# Altium schematic sheet CR20-0611.SchDoc
size A4; PageSetup: Record=PageOptions|CenterHorizontal=True|CenterVertical=True|PrintScale=1.00|XCorrection=1.00|YCorrection=1.00|PrintKind=0|BorderSize=5000000|LeftOffset=0|BottomOffset=0|Orientation=2|PaperLength=1000|PaperWidth=1000|Scale=100|PaperSource=7|PrintQuality=-3|MediaType=1|DitherType=10|PrintScaleMode=1|PaperKind=A4|PaperIndex=9
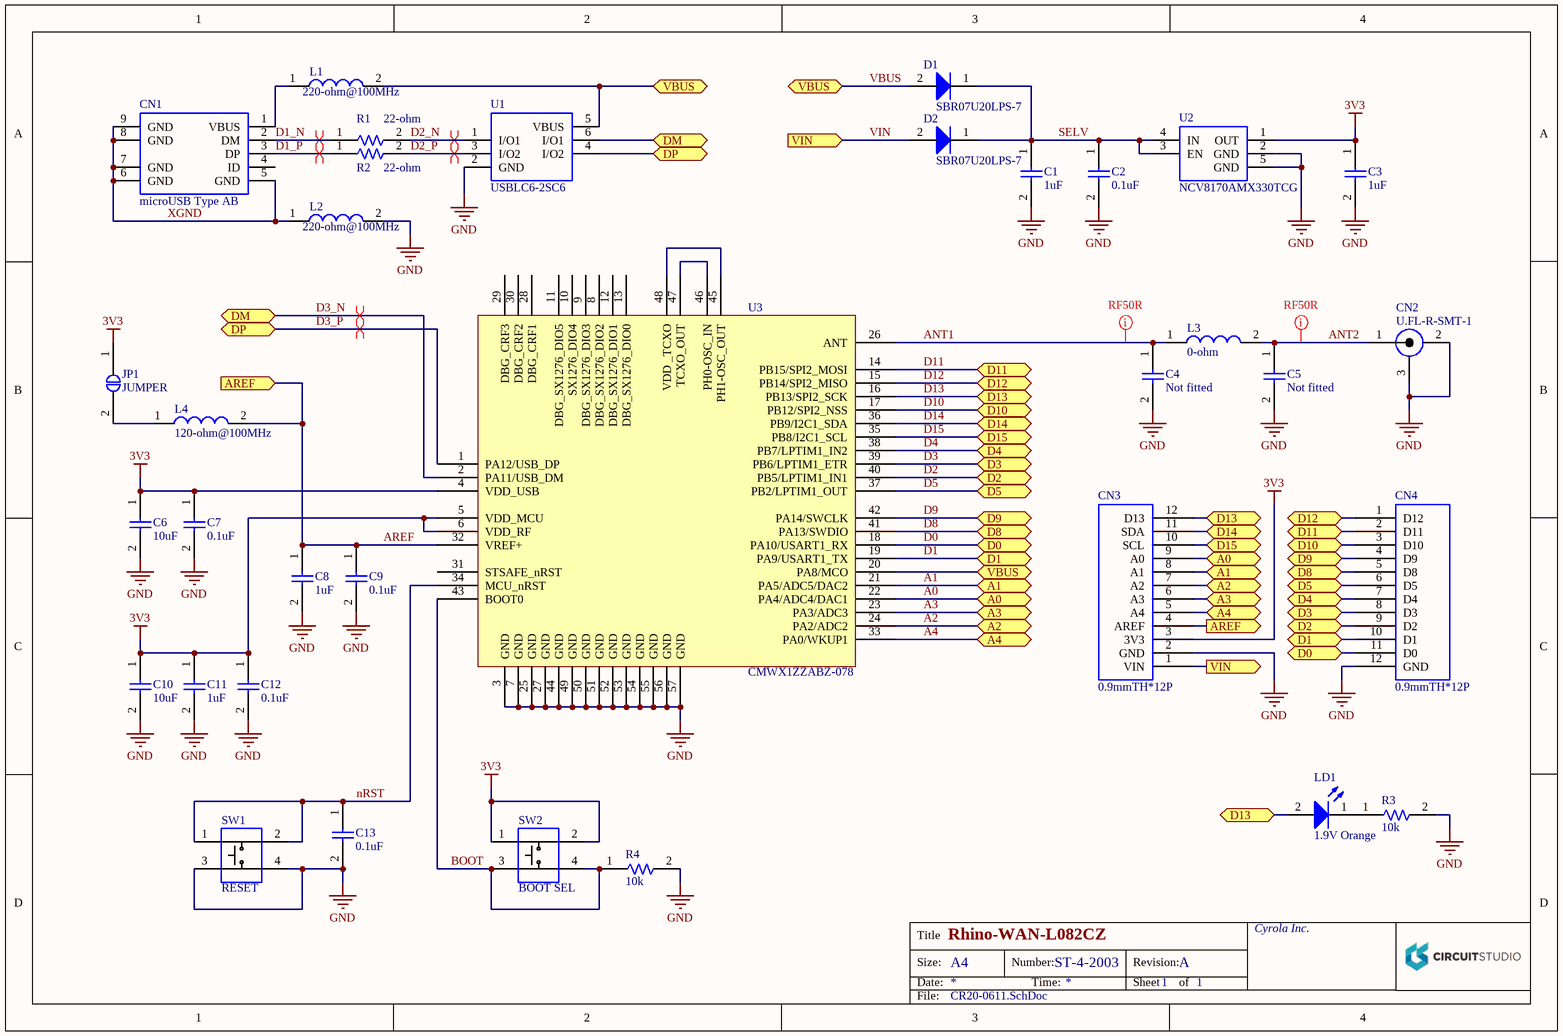
[diagram p0: CR20-0611.SchDoc]

## Parts
C1  1uF  [CAPC1005X06N]
C2  0.1uF  [CAPC1005X06N]
C3  1uF  [CAPC1005X06N]
C4  Not fitted  [CAPC0603X03N]
C5  Not fitted  [CAPC0603X03N]
C6  10uF  [CAPC1005X06N]
C7  0.1uF  [CAPC1005X06N]
C8  1uF  [CAPC1005X06N]
C9  0.1uF  [CAPC1005X06N]
C10  10uF  [CAPC1005X06N]
C11  1uF  [CAPC1005X06N]
C12  0.1uF  [CAPC1005X06N]
C13  0.1uF  [CAPC1005X06N]
CN1  microUSB Type AB  [1981584-1]
CN2  U.FL-R-SMT-1  [U_FL-R-SMT-1]
CN3  0.9mmTH*12P  [61301211121]
CN4  0.9mmTH*12P  [61301211121]
D1  SBR07U20LPS-7  [SBR07U20LPS-7]
D2  SBR07U20LPS-7  [SBR07U20LPS-7]
JP1  JUMPER  [Solder Jumper]
L1  220-ohm@100MHz  [INDC1005X06N]
L2  220-ohm@100MHz  [INDC1005X06N]
L3  0-ohm  [INDC0603X04N]
L4  120-ohm@100MHz  [INDC1005X06N]
LD1  1.9V Orange  [DIOM1006X02N]
R1  22-ohm  [RESC1005X04N]
R2  22-ohm  [RESC1005X04N]
R3  10k  [RESC1005X04N]
R4  10k  [RESC1005X04N]
SW1  RESET  [SKRPABE010]
SW2  BOOT SEL  [SKRPABE010]
U1  USBLC6-2SC6  [USBLC6-2SC6]
U2  NCV8170AMX330TCG  [NCV8170AMX330TCG]
U3  CMWX1ZZABZ-078  [CMWX1ZZABZ-078]

## Ports
A0 (bidir), A1 (bidir), A2 (bidir), A3 (bidir), A4 (bidir), AREF (in), AREF (out), D0 (bidir), D1 (bidir), D2 (bidir), D3 (bidir), D4 (bidir), D5 (bidir), D8 (bidir), D9 (bidir), D10 (bidir), D11 (bidir), D12 (bidir), D13 (bidir), D14 (bidir), D15 (bidir), DM (bidir), DP (bidir), VBUS (bidir), VIN (in), VIN (out)

## Nets
3V3: C3.1 C6.1 C7.1 C10.1 C11.1 C12.1 CN3.3(3V3) JP1.1 SW2.1 SW2.2 U2.1(OUT) U3.4(VDD_USB) U3.5(VDD_MCU) U3.6(VDD_RF)
GND: C1.2 C2.2 C3.2 C4.2 C5.2 C6.2 C7.2 C8.2 C9.2 C10.2 C11.2 C12.2 C13.2 CN2.2(GND) CN2.3(GND) CN3.2(GND) CN4.12(GND) L2.2 R3.2 R4.2 SW1.3 SW1.4 U1.2(GND) U2.2(GND) U2.5(GND) U3.3(GND) U3.7(GND) U3.25(GND) U3.27(GND) U3.44(GND) U3.49(GND) U3.50(GND) U3.51(GND) U3.52(GND) U3.53(GND) U3.54(GND) U3.55(GND) U3.56(GND) U3.57(GND)
A0: CN3.9(A0) U3.22(PA4/ADC4/DAC1) ; port A0
A1: CN3.8(A1) U3.21(PA5/ADC5/DAC2) ; port A1
A2: CN3.7(A2) U3.24(PA2/ADC2) ; port A2
A3: CN3.6(A3) U3.23(PA3/ADC3) ; port A3
A4: CN3.5(A4) U3.33(PA0/WKUP1) ; port A4
ANT1: C4.1 L3.1 U3.26(ANT)
ANT2: C5.1 CN2.1(SIG) L3.2
AREF: C8.1 C9.1 CN3.4(AREF) L4.2 U3.32(VREF+) ; port AREF
BOOT: R4.1 SW2.3 SW2.4 U3.43(BOOT0)
D0: CN4.11(D0) U3.18(PA10/USART1_RX) ; port D0
D1: CN4.10(D1) U3.19(PA9/USART1_TX) ; port D1
D1_N: CN1.2(DM) R1.1
D1_P: CN1.3(DP) R2.1
D2: CN4.9(D2) U3.40(PB5/LPTIM1_IN1) ; port D2
D2_N: R1.2 U1.1(I/O1)
D2_P: R2.2 U1.3(I/O2)
D3: CN4.8(D3) U3.39(PB6/LPTIM1_ETR) ; port D3
D3_N: U1.6(I/O1) U3.2(PA11/USB_DM) ; port DM
D3_P: U1.4(I/O2) U3.1(PA12/USB_DP) ; port DP
D4: CN4.7(D4) U3.38(PB7/LPTIM1_IN2) ; port D4
D5: CN4.6(D5) U3.37(PB2/LPTIM1_OUT) ; port D5
D8: CN4.5(D8) U3.41(PA13/SWDIO) ; port D8
D9: CN4.4(D9) U3.42(PA14/SWCLK) ; port D9
D10: CN4.3(D10) U3.17(PB12/SPI2_NSS) ; port D10
D11: CN4.2(D11) U3.14(PB15/SPI2_MOSI) ; port D11
D12: CN4.1(D12) U3.15(PB14/SPI2_MISO) ; port D12
D13: CN3.12(D13) LD1.2 U3.16(PB13/SPI2_SCK) ; port D13
D14: CN3.11(SDA) U3.36(PB9/I2C1_SDA) ; port D14
D15: CN3.10(SCL) U3.35(PB8/I2C1_SCL) ; port D15
nRST: C13.1 SW1.1 SW1.2 U3.34(MCU_nRST)
SELV: C1.1 C2.1 D1.1 D2.1 U2.3(EN) U2.4(IN)
VBUS: D1.2 L1.2 U1.5(VBUS) U3.20(PA8/MCO) ; port VBUS
VIN: CN3.1(VIN) D2.2 ; port VIN
XGND: CN1.5(GND) CN1.6(GND) CN1.7(GND) CN1.8(GND) CN1.9(GND) L2.1
NetCN1_1: CN1.1(VBUS) L1.1
NetJP1_2: JP1.2 L4.1
NetLD1_1: LD1.1 R3.1
NetU3_45: U3.45(PH1-OSC_OUT) U3.48(VDD__TCXO)
NetU3_46: U3.46(PH0-OSC_IN) U3.47(TCXO_OUT)

Not connected (* = marked no-connect by the designer): CN1 4(ID); U3 8(DBG_SX1276_DIO2) 9(DBG_SX1276_DIO3) 10(SX1276_DIO4) 11(DBG_SX1276_DIO5) 12(DBG_SX1276_DIO1) 13(DBG_SX1276_DIO0) 28(DBG_CRF1) 29(DBG_CRF3) 30(DBG_CRF2) 31(STSAFE_nRST)

## Layout directives
differential pair; differential pair class USB; net class USB: D1_N, D1_P, D2_N, D2_P, D3_N, D3_P
net class RF: ANT1, ANT2

## Notes on the sheet
- Title
- Size:
- Date:
- Rhino-WAN-L082CZ
- A4
- Number:
- Time:
- ST-4-2003
- Revision:
- Sheet
- 1
- A
- of
- Cyrola Inc.
- File:

## Library data of the parts
C1 C3 C8 C11 = GRM155R61E105KA12D: 1005 1uF 10% X5R 25V
C2 C7 C9 C12 C13 = GRM155R71H104KE14J: 1005 0.1uF 10% X7R 50V
C4 C5 = GRM0335C1H220FA01D: 0603
C6 C10 = GRM155R60J106ME15D: 1005 10uF 20% X5R 6.3V
CN1 = 1981584-1: Micro USB Receptacle Type AB
CN2 = U_FL-R-SMT-1: SMT ultra-small coaxial connector
CN3 = RHINO_WAN_L: WR-PHD Pin Header 12pin
CN4 = RHINO_WAN_R: WR-PHD Pin Header 12pin
D1 D2 = SBR07U20LPS-7: Super Barrier Rectifier
JP1 = SOLDER_JUMPER: Jumper Pad
L1 L2 = BLM15PX221SN1D: Chip Ferrite Bead 1005
L3 = LQP03HQ10NH02D: RK73Z1HTTC
L4 = BLM15AG121SN1D: Chip Ferrite Bead 1005
LD1 = SML-P11DTT86R: Ultra-small LED Orange
R1 R2 = RK73B1ETTP220J: 1005 22-ohm 1/10W
R3 R4 = RK73B1ETTP103J: 1005 10k 1/10W
SW1 SW2 = SKRPABE010: SPST Switch N/O 1.57N
U1 = USBLC6-2SC6: ESD protection
U2 = NCV8170AMX330TCG: Ultra-Low Noise LDO Regulator
U3 = CMWX1ZZABZ-078: Sub-G Module